# Altium schematic sheet Remote.SchDoc
size 243 x 116 mm; SheetNumber: 1; SheetTotal: 1
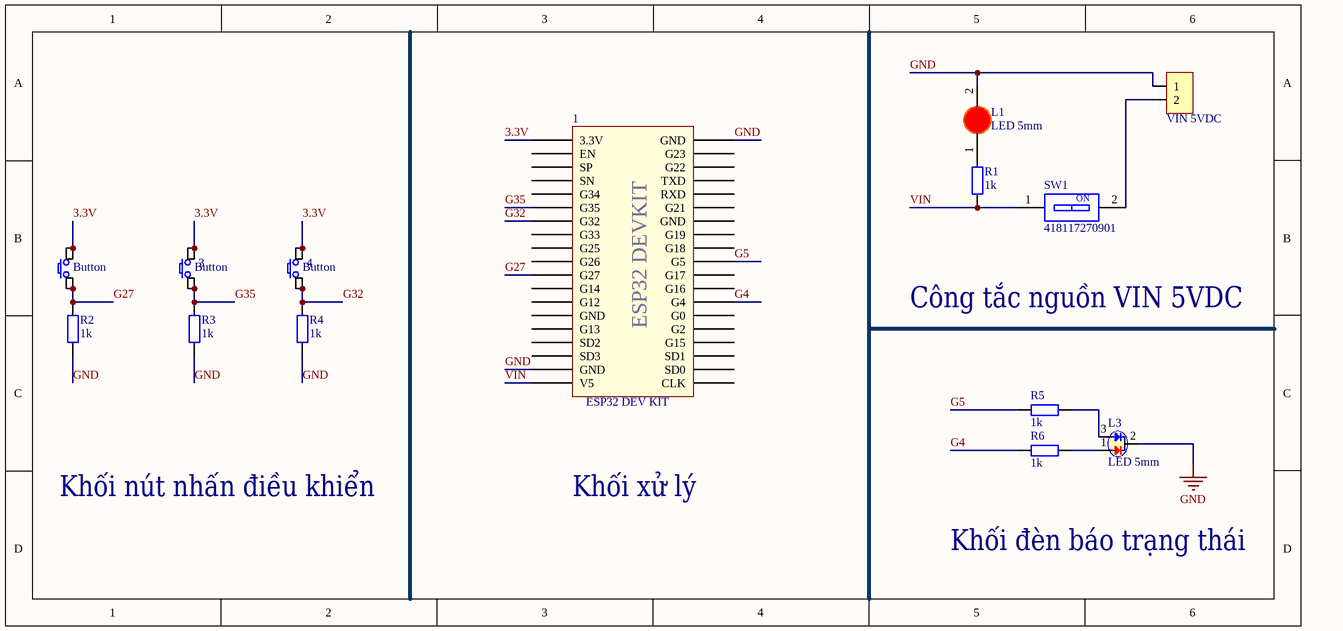
[diagram p0: Remote.SchDoc]

## Parts
1  ESP32 DEV KIT  [ESP32 DEVKIT]
2  Button  [SW/4/06MM]
3  Button  [SW/4/06MM]
4  Button  [SW/4/06MM]
JP3  VIN 5VDC  [JP 1x2 DT]
L1  LED 5mm  [LED-5MM-RED]
L3  LED 5mm  [LED-5MM 2 MAU]
R1  1k  [tro vach 1/4w]
R2  1k  [tro vach 1/4w]
R3  1k  [tro vach 1/4w]
R4  1k  [tro vach 1/4w]
R5  1k  [tro vach 1/4w]
R6  1k  [tro vach 1/4w]
SW1  418117270901  [418117270901]

## Nets
GND: 1.18(GND) 1.38(GND) JP3.1 L1.2(K) L3.2(Katot) R2.1 R3.1 R4.1
3.3V: 1.1(3.3V) 2.3 2.4 3.3 3.4 4.3 4.4
G4: 1.26(G4) R6.2
G5: 1.29(G5) R5.2
G27: 1.11(G27) 2.1 2.2 R2.2
G32: 1.7(G32) 4.1 4.2 R4.2
G35: 1.6(G35) 3.1 3.2 R3.2
VIN: 1.19(V5) R1.1 SW1.1
NetJP3_2: JP3.2 SW1.2
NetL1_1: L1.1(A) R1.2
NetL3_1: L3.1(D) R6.1
NetL3_3: L3.3(X) R5.1

Not connected (* = marked no-connect by the designer): 1 2(EN) 3(SP) 4(SN) 5(G34) 8(G33) 9(G25) 10(G26) 12(G14) 13(G12) 14(GND) 15(G13) 16(SD2) 17(SD3) 20(CLK) 21(SD0) 22(SD1) 23(G15) 24(G2) 25(G0) 27(G16) 28(G17) 30(G18) 31(G19) 32(GND) 33(G21) 34(RXD) 35(TXD) 36(G22) 37(G23)

## Notes on the sheet
- Công tắc nguồn VIN 5VDC
- Khối nút nhấn điều khiển
- Khối xử lý
- Khối đèn báo trạng thái
- (in symbol CMP-1435-00001-2) ON
- (in symbol ESP32 DEV KIT) ESP32 DEVKIT

## Library data of the parts
2-4 = SW SPST 4-pin: Tact switch 4-pin
JP3 = JP 1x2 2.54 Duc Thang: Cắm; Ten_Linh_Kien: Jump Đơn Đực 2.54MM 1x40P Thẳng 11MM; Don_Vi: Con; Ma_Hang: MH000903; Ghi_Chu: *; Kieu_Chan: *; Chung_Loai: Cắm
L1 = LED 5mm Do: Cắm; Don_Vi: Con; Ma_Hang: MH008967; Ten_Linh_Kien: Led 5MM Phủ Đỏ (1000c); Ghi_Chu: *; Kieu_Chan: *; Chung_Loai: Cắm
L3 = LED 5mm 2 mau Katot chung: Cắm; Don_Vi: Con; Ma_Hang: MH001547; Ten_Linh_Kien: Led 5MM 2 Mầu Katot Xanh Đỏ (10c); Ghi_Chu: *; Kieu_Chan: *; Chung_Loai: Cắm
R1-R6 = Tro Vach 1/4W 5% 1k: Cắm; Don_Vi: Con; So_Chan: 2; Ten_Linh_Kien: Trở Vạch 1/4w 5% 1k; Ma_Hang: MH007390; Chung_Loai: Cắm; Kieu_Chan: *
SW1 = CMP-1435-00001-2: NexarPartId: 22584988; Mechanical Life: 5kcycles; Number of Positions: 1; Life (Cycles): 2kcycles; Insulation Resistance: 100MΩ; Contact Resistance: 50mΩ; Voltage Rating: 24V; Current Rating: 25mA; Body Material: Nylon, Polyamide; Washable: No; Throw Configuration: SPST; Pitch: 2.54mm; Lead Free: Lead Free; Mount: Through Hole; Max Operating Temperature: 85°C; RoHS: Compliant; Number of Pins: 1; Height: 6.95mm; Min Operating Temperature: -40°C; Termination: PC Pin; Number of Circuits: 1; Contact Current Rating: 25mA; Contact Plating: Gold; Electrical Life: 2kcycles; Voltage Rating (DC): 24V; Length: 3.84mm